# EAGLE design rec (EAGLE 7.7.0)
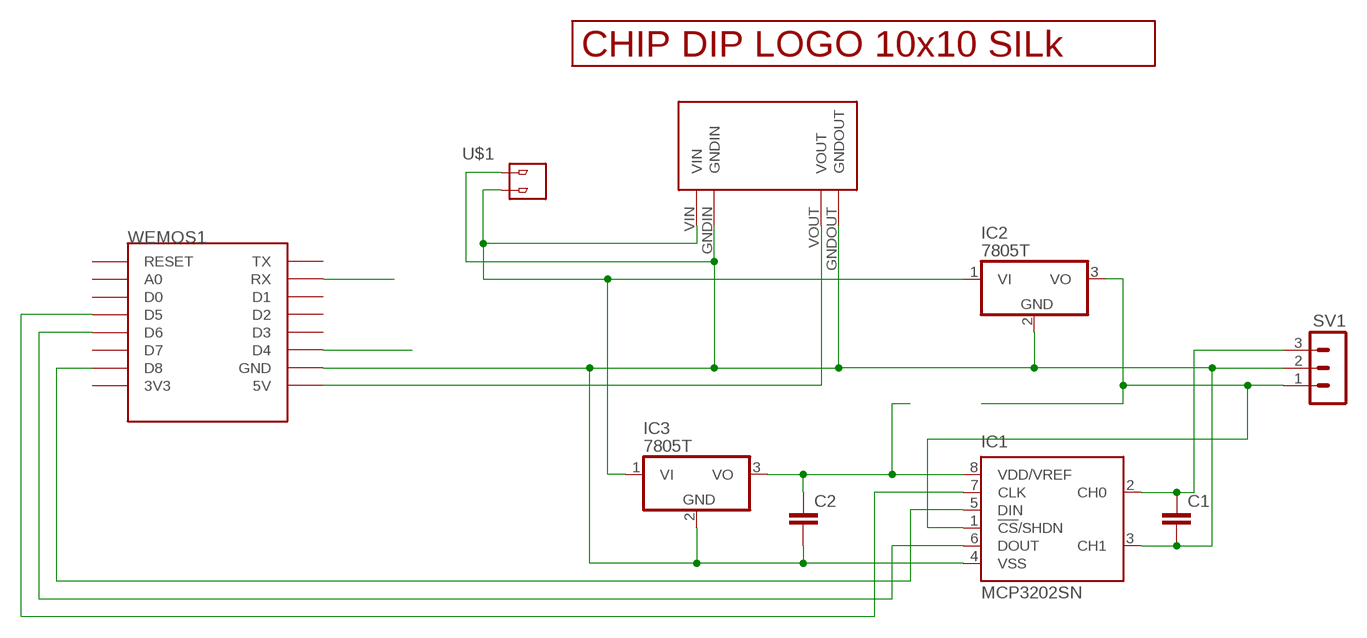
[diagram p0: schematic, sheet 1]

## Parts
C1  C-EUC0805  [C0805]
C2  C-EUC0805  [C0805]
IC1  MCP3202SN  [SO-08]
IC2  7805T  [TO220H]
IC3  7805T  [TO220H]
SV1  MA03-1  [MA03-1]
U$1  2_PIN_CONNECTOR  [2_SCREW_PIN]
U$2  LOGO_10X10_SILK  [LOGO2_10X10_SILK]
U$3  MP1584EN  [MP1584EN]
WEMOS1  WEMOS-D1-MINI  [WEMOS-D1-MINI]

## Nets
GND: C1.2 C2.2 IC1.3(CH1) IC1.4(VSS) IC2.2(GND) IC3.2(GND) SV1.2 U$1.P$1 U$3.GNDIN U$3.GNDOUT WEMOS1.GND
N$2: IC2.1(VI) IC3.1(VI) U$1.P$2 U$3.VIN
N$3: U$3.VOUT WEMOS1.5V
N$5: WEMOS1.D4
N$6: WEMOS1.RX
N$7: IC1.5(DIN) WEMOS1.D8
N$8: IC1.7(CLK) WEMOS1.D5
N$9: C1.1 IC1.2(CH0) SV1.3
N$11: IC1.1(!CS!/SHDN) IC2.3(VO) SV1.1
N$13: C2.1 IC1.8(VDD/VREF) IC3.3(VO)
N$16: IC1.6(DOUT) WEMOS1.D6
Unconnected: WEMOS1.3V3 WEMOS1.A0 WEMOS1.D0 WEMOS1.D1 WEMOS1.D2 WEMOS1.D3 WEMOS1.D7 WEMOS1.RESET WEMOS1.TX

## Library data of the parts
C1 C2 = rcl:C-EU: CAPACITOR, European symbol
IC1 = microchip:MCP3202: 2.7V Dual Channel 12-Bit A/D Converter with SPI Serial Interface Source: http://ww1.microchip.com/downloads/en/DeviceDoc/21034D.pdf; MF: MICROCHIP; MPN: MCP3202-CI/SN; OC_FARNELL: 1196803; OC_NEWARK: 19C7207
IC2 IC3 = linear:78*: Positive VOLTAGE REGULATOR Source: http://cache.national.com/ds/LM/LM78L05.pdf http://www.fairchildsemi.com/ds/LM/LM7805.pdf
SV1 = con-lstb:MA03-1: PIN HEADER; OC_FARNELL: unknown; OC_NEWARK: unknown
U$1 = JKW_CHIP:2_PIN_CONNECTOR
U$2 = JKW_CHIP:LOGO_10X10_SILK
U$3 = JKW_CHIP:MP1584EN
WEMOS1 = esp8266modules:WEMOS-D1-MINI: WeMos.cc D1 mini ESP8266 module

## Board
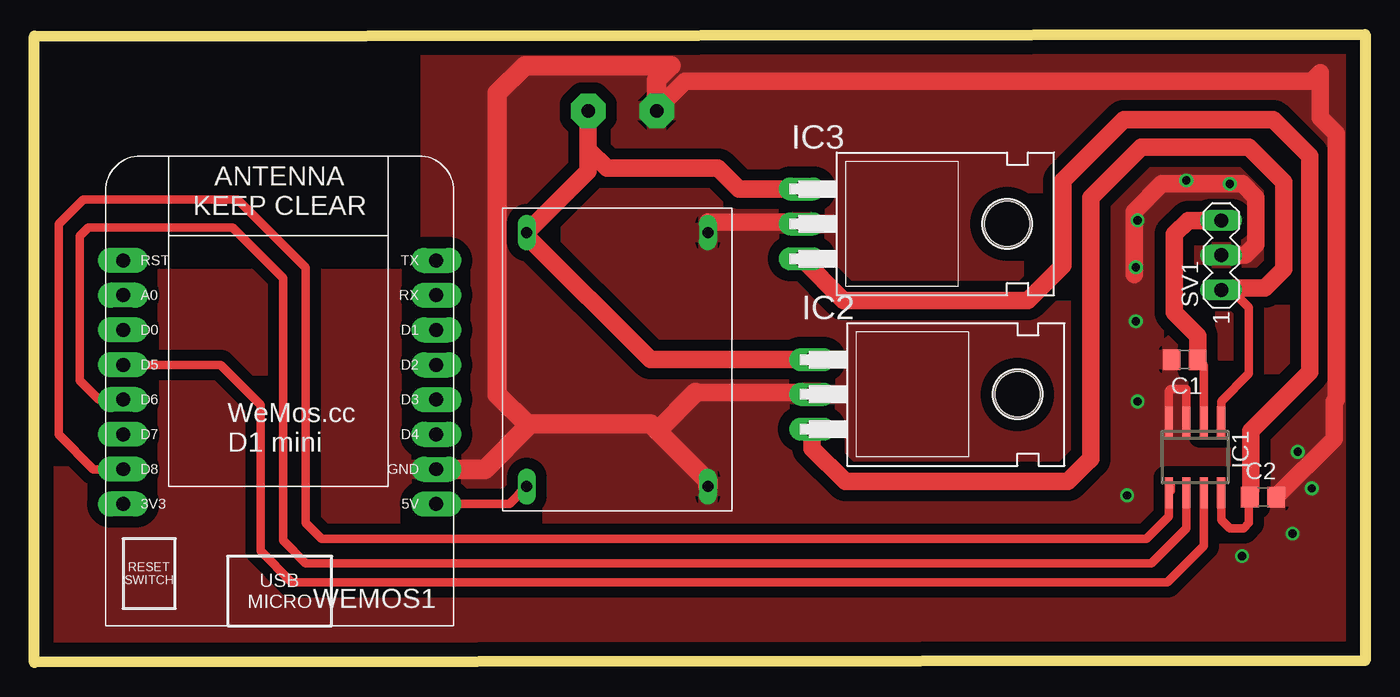
[diagram p1: board, top side]
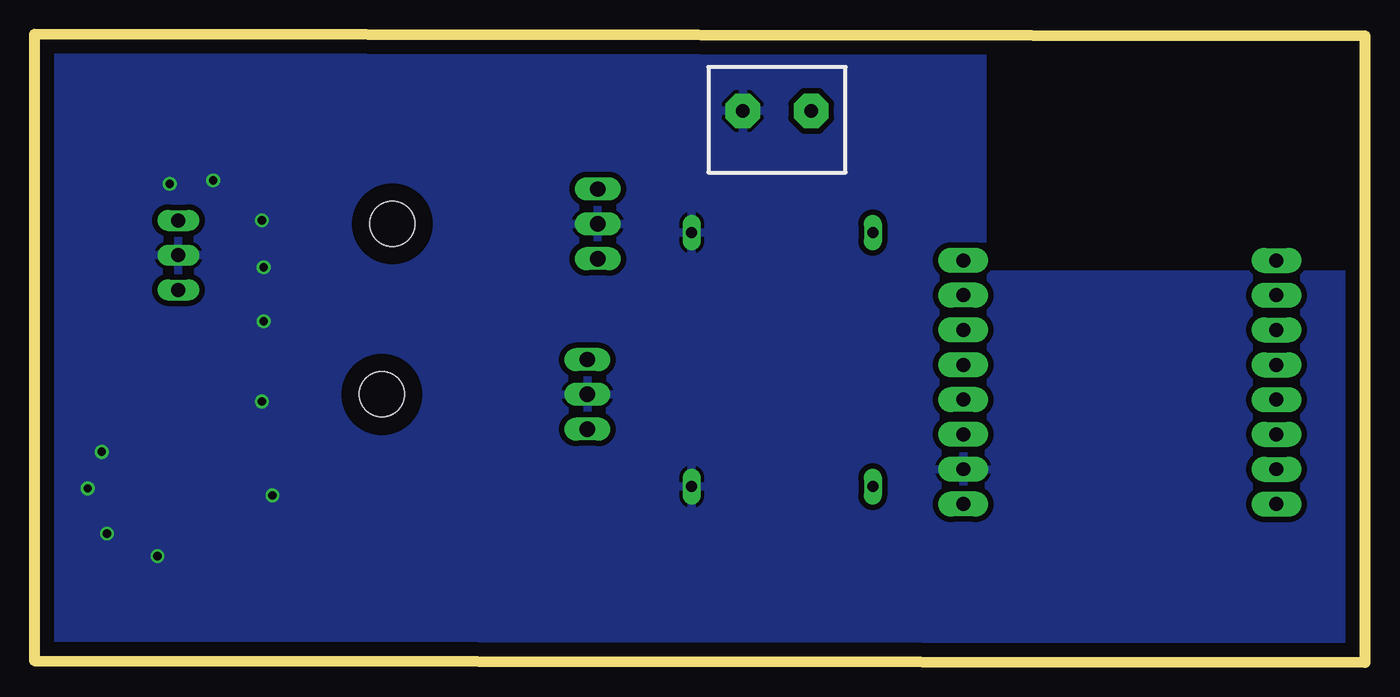
[diagram p2: board, bottom side, seen from below]

Size 97.13 x 45.85 mm. Coordinates in mm from the lower left corner, seen from the top.
Outline: 0,0 0,45.72 97.13,45.85 97.13,0.13 0,0
Copper layers (1*16): Top 0.035mm / dielectric 1.5mm / Bottom 0.035mm
Design rules "default": minimum track width 10mil, minimum drill 24mil, track to track 8mil, track to pad 8mil, pad to pad 8mil, via to via 8mil, smd to smd 8mil, copper to edge 40mil, drill to drill 8mil, minimum pad ring 10mil, minimum via ring 8mil, stop-mask expansion 4mil, vias tented up to drill 0mil, thermal gap 10mil
tRestrict: area 1.3,29.8 to 27.1,45
bRestrict: area 1.4,29.3 to 26.9,44.8

### Footprints (pad centres in the part's own frame; a part is rotated, then mirrored left to right if it is on the bottom)
C0805 = smd 1.3 x 1.5: 1 -0.95,0; 2 0.95,0
SO-08 = smd 0.6 x 2.2: 1 -1.905,-2.6; 2 -0.635,-2.6; 3 0.635,-2.6; 4 1.905,-2.6; 5 1.905,2.6; 6 0.635,2.6; 7 -0.635,2.6; 8 -1.905,2.6
TO220H = drill 1.118 long: 1 -2.54,-10.16; 2 0,-10.16; 3 2.54,-10.16 | hole 3.302: 0,4.826
MA03-1 = drill 1.016 long: 1 -2.54,0; 2 0,0; 3 2.54,0
2_SCREW_PIN = drill 1 pad 2.54 octagon: P$1 -2.5,0.5; P$2 2.5,0.5
MP1584EN = drill 0.8 long: GNDIN 1.778,14.986; GNDOUT 20.32,14.986; VIN 1.778,1.778; VOUT 20.32,1.778
WEMOS-D1-MINI = drill 1.016 pad 1.829 long: 3V3 -10.16,-10.16; 5V 12.7,-10.16; A0 -10.16,5.08; D0 -10.16,2.54; D1 12.7,2.54; D2 12.7,0; D3 12.7,-2.54; D4 12.7,-5.08; D5 -10.16,0; D6 -10.16,-2.54; D7 -10.16,-5.08; D8 -10.16,-7.62; GND 12.7,-7.62; RESET -10.16,7.62; RX 12.7,5.08; TX 12.7,7.62

### Placement (x,y rotation side)
C1  83.95,22.1 180 top
C2  89.66,12.06 0 top
IC1  84.71,14.99 180 top
IC2  66.93,19.56 270 top
IC3  66.17,32 270 top
SV1  86.61,29.72 90 top
U$1  42.93,39.75 0 bottom
U$2  -46.86,36.83 0 top  (outside the outline)
U$3  34.16,33.15 270 top
WEMOS1  16.64,21.72 0 top

### Tracks (layer width: path | path; a pad name or v marks a point on that pad's centre or on a via)
GND  (via drill 0.6)
  Top 0.61: IC1.3 84.07,19.94 82.93,19.94 82.8,19.81 IC1.4
  Top 1.27: IC3.2 55.88,32.13 49.15,32.13 U$3.GNDIN | IC2.2 56.64,19.68 48.26,19.68 | SV1.2 88.39,29.72 89.15,30.48 89.15,33.91 88.14,34.92 v87.25,34.92 82.3,34.92 80.26,32.89 80.26,28.32 | C2.2 94.87,16.32 94.87,19.05 95,19.18 95,38.61 93.85,39.75 93.85,43.05 93.22,42.42 47.5,42.42 45.43,40.35 U$1.P$1
  Top 1.422: U$3.GNDOUT 49.15,13.21 45.47,16.89 | 45.47,16.89 44.96,17.4 36.2,17.4 36.07,17.27 | 36.07,17.27 32.89,14.1 WEMOS1.GND | 36.07,17.27 33.78,19.56 33.78,41.53 35.81,43.56 46.48,43.56 45.43,42.51 U$1.P$1 | 48.26,19.68 45.47,16.89
  other vias: 80.39,28.83 80.52,32.26 84.07,35.18 80.39,24.89 80.52,19.05 79.76,12.19 88.14,7.75 91.82,9.4 93.22,12.7 92.2,15.37
  pour Top (isolate 0.813): 91.28,-0.25 0,0.38 0,45.72 96.13,45.72 96.13,-0.13
  pour Bottom (isolate 0.406): 3.68,0.13 96.77,0.13 96.77,45.59 0.25,45.59 0.25,0
N$2
  Top 1.27: IC3.1 51.44,34.54 49.91,36.07 41.78,36.07 40.43,37.42 | 40.43,37.42 U$1.P$2 | 40.43,37.42 40.43,35.85 U$3.VIN 35.94,31.11 44.96,22.1 IC2.1
N$3
  Top 0.61: WEMOS1.5V 34.67,11.56 U$3.VOUT
N$7
  Top 0.61: WEMOS1.D8 4.32,14.1 1.78,16.64 1.78,32 3.56,33.78 14.86,33.78 19.81,28.83 19.81,10.16 20.95,9.02 81.15,9.02 82.8,10.67 IC1.5 | IC1.5 82.8,12.83 82.93,12.95 82.93,12.51 IC1.5
N$8
  Top 0.61: WEMOS1.D5 13.59,21.72 16.51,18.8 16.51,8.13 18.8,5.84 82.68,5.84 85.34,8.51 IC1.7
N$9
  Top 0.61: IC1.2 85.34,21.65 C1.1
  Top 1.27: SV1.3 84.2,32.26 83.19,31.24 83.19,25.53 84.9,23.82 C1.1
N$11
  Top 0.61: IC1.1 86.61,19.05 88.65,21.08 88.65,25.91 87.25,27.3
  Top 1.27: SV1.1 86.74,27.3 87.25,27.3 89.79,27.3 91.19,28.7 91.19,35.05 88.65,37.59 80.77,37.59 77.09,33.91 77.09,14.86 76.71,14.48 75.44,13.21 59.18,13.21 56.77,15.62 IC2.3
N$13
  Top 0.61: IC1.8 86.61,10.41 87.25,9.78 88.27,9.78 88.65,10.16 88.65,12 C2.1 88.77,12.13 88.77,12.57 | 88.52,14.73 88.77,14.48
  Top 1.27: IC3.3 59.05,26.42 72.52,26.42 75.06,28.96 75.06,35.18 79.5,39.62 90.42,39.62 93.09,36.96 93.09,21.21 88.77,16.89 88.77,14.48 88.77,12.57
N$16
  Top 0.61: WEMOS1.D6 4.7,19.18 3.3,20.57 3.3,31.11 3.94,31.75 14.48,31.75 18.16,28.07 18.16,8.89 19.81,7.24 81.53,7.24 84.07,9.78 IC1.6